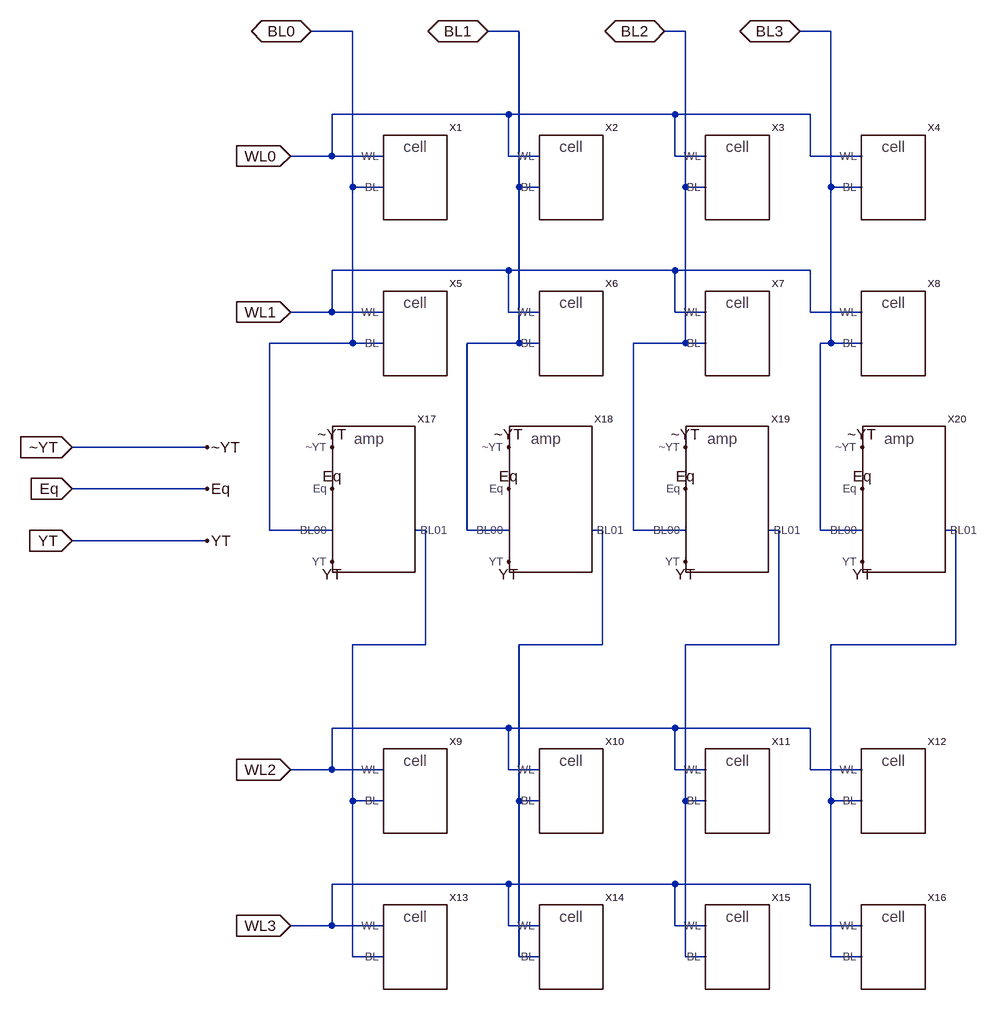
[diagram p0: schematic open_bitline_array.asc]
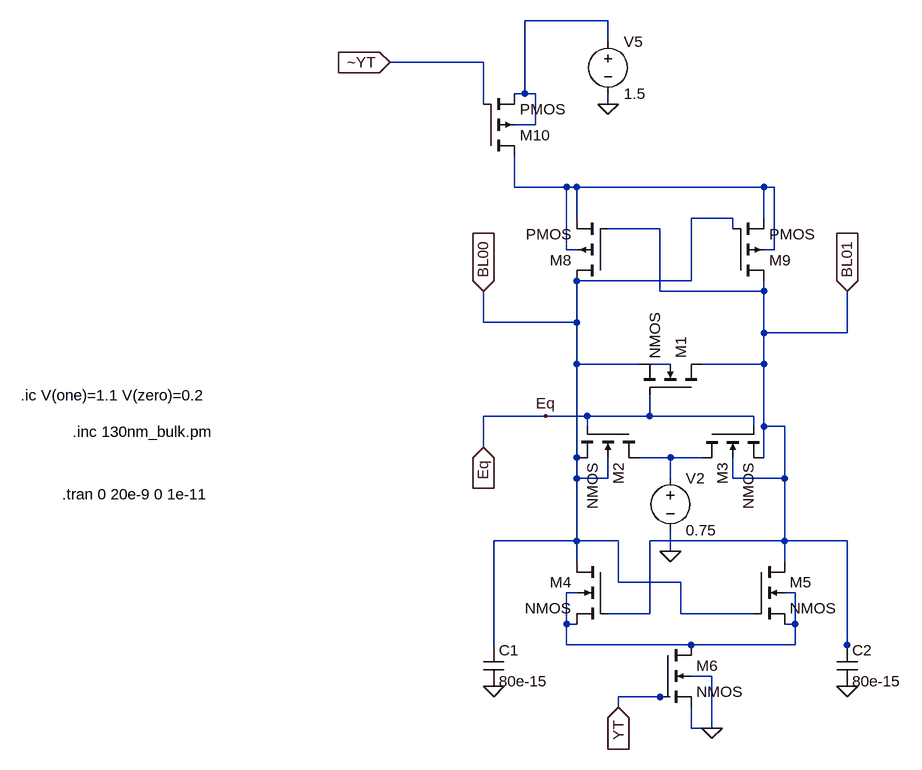
[diagram p1: sub-circuit amplifaer.asc]
open_bitline_array.asc, the LTspice schematic file:
Version 4
SHEET 1 984 1560
WIRE 0 -96 -64 -96
WIRE 256 -96 208 -96
WIRE 512 -96 480 -96
WIRE 736 -96 688 -96
WIRE 240 32 -32 32
WIRE 496 32 240 32
WIRE 704 32 496 32
WIRE -32 96 -32 32
WIRE -32 96 -96 96
WIRE 48 96 -32 96
WIRE 240 96 240 32
WIRE 288 96 240 96
WIRE 496 96 496 32
WIRE 544 96 496 96
WIRE 704 96 704 32
WIRE 784 96 704 96
WIRE 0 144 0 -96
WIRE 48 144 0 144
WIRE 256 144 256 -96
WIRE 288 144 256 144
WIRE 512 144 512 -96
WIRE 544 144 512 144
WIRE 736 144 736 -96
WIRE 784 144 736 144
WIRE 240 272 -32 272
WIRE 496 272 240 272
WIRE 704 272 496 272
WIRE -32 336 -32 272
WIRE -32 336 -96 336
WIRE 48 336 -32 336
WIRE 240 336 240 272
WIRE 288 336 240 336
WIRE 496 336 496 272
WIRE 544 336 496 336
WIRE 704 336 704 272
WIRE 784 336 704 336
WIRE 0 384 0 144
WIRE 0 384 -128 384
WIRE 48 384 0 384
WIRE 256 384 256 144
WIRE 256 384 176 384
WIRE 288 384 256 384
WIRE 512 384 512 144
WIRE 512 384 432 384
WIRE 544 384 512 384
WIRE 736 384 736 144
WIRE 736 384 720 384
WIRE 784 384 736 384
WIRE -224 544 -432 544
WIRE -224 608 -432 608
WIRE -128 672 -128 384
WIRE -32 672 -128 672
WIRE 112 672 96 672
WIRE 176 672 176 384
WIRE 240 672 176 672
WIRE 384 672 368 672
WIRE 432 672 432 384
WIRE 512 672 432 672
WIRE 656 672 640 672
WIRE 720 672 720 384
WIRE 784 672 720 672
WIRE 928 672 912 672
WIRE -224 688 -432 688
WIRE 112 848 112 672
WIRE 112 848 0 848
WIRE 384 848 384 672
WIRE 384 848 256 848
WIRE 656 848 656 672
WIRE 656 848 512 848
WIRE 928 848 928 672
WIRE 928 848 736 848
WIRE 240 976 -32 976
WIRE 496 976 240 976
WIRE 704 976 496 976
WIRE -32 1040 -32 976
WIRE -32 1040 -96 1040
WIRE 48 1040 -32 1040
WIRE 240 1040 240 976
WIRE 288 1040 240 1040
WIRE 496 1040 496 976
WIRE 544 1040 496 1040
WIRE 704 1040 704 976
WIRE 784 1040 704 1040
WIRE 0 1088 0 848
WIRE 48 1088 0 1088
WIRE 256 1088 256 848
WIRE 288 1088 256 1088
WIRE 512 1088 512 848
WIRE 544 1088 512 1088
WIRE 736 1088 736 848
WIRE 784 1088 736 1088
WIRE 240 1216 -32 1216
WIRE 496 1216 240 1216
WIRE 704 1216 496 1216
WIRE -32 1280 -32 1216
WIRE -32 1280 -96 1280
WIRE 48 1280 -32 1280
WIRE 240 1280 240 1216
WIRE 288 1280 240 1280
WIRE 496 1280 496 1216
WIRE 544 1280 496 1280
WIRE 704 1280 704 1216
WIRE 784 1280 704 1280
WIRE 0 1328 0 1088
WIRE 48 1328 0 1328
WIRE 256 1328 256 1088
WIRE 288 1328 256 1328
WIRE 512 1328 512 1088
WIRE 544 1328 512 1328
WIRE 736 1328 736 1088
WIRE 784 1328 736 1328
FLAG -32 544 ~YT
FLAG 240 544 ~YT
FLAG 784 544 ~YT
FLAG -32 608 Eq
FLAG 240 608 Eq
FLAG 784 608 Eq
FLAG -32 720 YT
FLAG 240 720 YT
FLAG 784 720 YT
FLAG -96 96 WL0
IOPIN -96 96 In
FLAG -96 336 WL1
IOPIN -96 336 In
FLAG -96 1040 WL2
IOPIN -96 1040 In
FLAG -96 1280 WL3
IOPIN -96 1280 In
FLAG -64 -96 BL0
IOPIN -64 -96 BiDir
FLAG 208 -96 BL1
IOPIN 208 -96 BiDir
FLAG 480 -96 BL2
IOPIN 480 -96 BiDir
FLAG 688 -96 BL3
IOPIN 688 -96 BiDir
FLAG -224 544 ~YT
FLAG -224 688 YT
FLAG -224 608 Eq
FLAG -432 544 ~YT
IOPIN -432 544 In
FLAG -432 608 Eq
IOPIN -432 608 In
FLAG -432 688 YT
IOPIN -432 688 In
FLAG 512 608 Eq
FLAG 512 544 ~YT
FLAG 512 720 YT
SYMBOL memory_cell 368 128 R0
SYMATTR InstName X2
SYMBOL memory_cell 624 128 R0
SYMATTR InstName X3
SYMBOL memory_cell 864 128 R0
SYMATTR InstName X4
SYMBOL memory_cell 128 368 R0
SYMATTR InstName X5
SYMBOL memory_cell 368 368 R0
SYMATTR InstName X6
SYMBOL memory_cell 624 368 R0
SYMATTR InstName X7
SYMBOL memory_cell 864 368 R0
SYMATTR InstName X8
SYMBOL memory_cell 128 1072 R0
SYMATTR InstName X9
SYMBOL memory_cell 368 1072 R0
SYMATTR InstName X10
SYMBOL memory_cell 624 1072 R0
SYMATTR InstName X11
SYMBOL memory_cell 864 1072 R0
SYMATTR InstName X12
SYMBOL memory_cell 128 1312 R0
SYMATTR InstName X13
SYMBOL memory_cell 368 1312 R0
SYMATTR InstName X14
SYMBOL memory_cell 624 1312 R0
SYMATTR InstName X15
SYMBOL memory_cell 864 1312 R0
SYMATTR InstName X16
SYMBOL amplifaer 80 576 R0
SYMATTR InstName X17
SYMBOL memory_cell 128 128 R0
SYMATTR InstName X1
SYMBOL amplifaer 352 576 R0
SYMATTR InstName X18
SYMBOL amplifaer 624 576 R0
SYMATTR InstName X19
SYMBOL amplifaer 896 576 R0
SYMATTR InstName X20

amplifaer.asc, the sub-circuit schematic file:
Version 4
SHEET 1 880 680
WIRE 208 -544 80 -544
WIRE 208 -512 208 -544
WIRE 16 -480 -128 -480
WIRE 80 -432 80 -544
WIRE 80 -432 64 -432
WIRE 96 -432 80 -432
WIRE 16 -416 16 -480
WIRE 208 -416 208 -432
WIRE 96 -384 96 -432
WIRE 96 -384 64 -384
WIRE 64 -288 64 -336
WIRE 144 -288 64 -288
WIRE 160 -288 144 -288
WIRE 448 -288 160 -288
WIRE 464 -288 448 -288
WIRE 160 -240 160 -288
WIRE 400 -240 336 -240
WIRE 448 -240 448 -288
WIRE 288 -224 208 -224
WIRE 400 -224 400 -240
WIRE 144 -192 144 -288
WIRE 160 -192 144 -192
WIRE 464 -192 464 -288
WIRE 464 -192 448 -192
WIRE 336 -144 336 -240
WIRE 336 -144 160 -144
WIRE 288 -128 288 -224
WIRE 448 -128 448 -144
WIRE 448 -128 288 -128
WIRE 16 -80 16 -128
WIRE 160 -80 160 -144
WIRE 160 -80 16 -80
WIRE 448 -64 448 -128
WIRE 576 -64 576 -128
WIRE 576 -64 448 -64
WIRE 160 -16 160 -80
WIRE 256 -16 160 -16
WIRE 304 -16 272 -16
WIRE 448 -16 448 -64
WIRE 448 -16 352 -16
WIRE 112 64 16 64
WIRE 176 64 112 64
WIRE 272 64 272 32
WIRE 272 64 176 64
WIRE 432 64 272 64
WIRE 176 80 176 64
WIRE 432 80 432 64
WIRE 448 80 448 -16
WIRE 480 80 448 80
WIRE 16 112 16 64
WIRE 160 128 160 -16
WIRE 304 128 256 128
WIRE 352 128 304 128
WIRE 448 128 448 80
WIRE 160 160 160 128
WIRE 208 160 208 128
WIRE 208 160 160 160
WIRE 304 160 304 128
WIRE 400 160 400 128
WIRE 480 160 480 80
WIRE 480 160 400 160
WIRE 160 256 160 160
WIRE 160 256 32 256
WIRE 224 256 160 256
WIRE 480 256 480 160
WIRE 480 256 272 256
WIRE 576 256 480 256
WIRE 304 272 304 240
WIRE 160 288 160 256
WIRE 480 288 480 256
WIRE 224 320 224 256
WIRE 320 320 224 320
WIRE 160 336 144 336
WIRE 496 336 480 336
WIRE 272 368 272 256
WIRE 272 368 208 368
WIRE 320 368 320 320
WIRE 432 368 320 368
WIRE 144 384 144 336
WIRE 160 384 144 384
WIRE 496 384 496 336
WIRE 496 384 480 384
WIRE 32 416 32 256
WIRE 144 416 144 384
WIRE 336 416 144 416
WIRE 496 416 496 384
WIRE 496 416 336 416
WIRE 576 416 576 256
WIRE 576 432 576 416
WIRE 368 464 336 464
WIRE 288 496 224 496
WIRE 304 496 288 496
WIRE 224 512 224 496
WIRE 336 544 336 512
WIRE 368 544 368 464
WIRE 368 544 336 544
FLAG 304 272 0
FLAG 576 480 0
FLAG 32 480 0
FLAG 368 544 0
FLAG 112 64 Eq
FLAG 208 -416 0
FLAG 16 112 Eq
IOPIN 16 112 In
FLAG -128 -480 ~YT
IOPIN -128 -480 In
FLAG 16 -128 BL00
IOPIN 16 -128 In
FLAG 224 512 YT
IOPIN 224 512 In
FLAG 576 -128 BL01
IOPIN 576 -128 In
SYMBOL nmos4 352 32 M270
SYMATTR InstName M1
SYMATTR Value2 l=130e-9 w=1300e-9 ad=676000e-18 as=676000e-18 pd=3640e-9 ps=3640e-9
SYMBOL nmos4 256 80 R90
SYMATTR InstName M2
SYMATTR Value2 l=130e-9 w=1300e-9 ad=676000e-18 as=676000e-18 pd=3640e-9 ps=3640e-9
SYMBOL nmos4 352 80 M90
SYMATTR InstName M3
SYMATTR Value2 l=130e-9 w=1300e-9 ad=676000e-18 as=676000e-18 pd=3640e-9 ps=3640e-9
SYMBOL voltage 304 144 R0
WINDOW 123 0 0 Left 0
WINDOW 39 0 0 Left 0
SYMATTR InstName V2
SYMATTR Value 0.75
SYMBOL cap 16 416 R0
SYMATTR InstName C1
SYMATTR Value 80e-15
SYMBOL cap 560 416 R0
SYMATTR InstName C2
SYMATTR Value 80e-15
SYMBOL nmos4 208 288 M0
SYMATTR InstName M4
SYMATTR Value2 l=130e-9 w=1300e-9 ad=676000e-18 as=676000e-18 pd=3640e-9 ps=3640e-9
SYMBOL nmos4 432 288 R0
SYMATTR InstName M5
SYMATTR Value2 l=130e-9 w=1300e-9 ad=676000e-18 as=676000e-18 pd=3640e-9 ps=3640e-9
SYMBOL nmos4 288 416 R0
SYMATTR InstName M6
SYMATTR Value2 l=130e-9 w=1300e-9 ad=676000e-18 as=676000e-18 pd=3640e-9 ps=3640e-9
SYMBOL pmos4 208 -144 R180
SYMATTR InstName M8
SYMATTR Value2 l=130e-9 w=2600e-9 ad=676000e-18 as=676000e-18 pd=3640e-9 ps=3640e-9
SYMBOL pmos4 400 -144 M180
SYMATTR InstName M9
SYMATTR Value2 l=130e-9 w=12600e-9 ad=676000e-18 as=676000e-18 pd=3640e-9 ps=3640e-9
SYMBOL pmos4 16 -336 M180
SYMATTR InstName M10
SYMATTR Value2 l=130e-9 w=2600e-9 ad=676000e-18 as=676000e-18 pd=3640e-9 ps=3640e-9
SYMBOL voltage 208 -528 R0
WINDOW 123 0 0 Left 0
WINDOW 39 0 0 Left 0
SYMATTR InstName V5
SYMATTR Value 1.5
TEXT -616 88 Left 2 !.inc 130nm_bulk.pm
TEXT -632 184 Left 2 !.tran 0 20e-9 0 1e-11
TEXT -696 32 Left 2 !.ic V(one)=1.1 V(zero)=0.2

The netlist it stands for:
* open_bitline_array.asc
XX2 WL0 BL1 memory_cell  ; pins WL BL
XX3 WL0 BL2 memory_cell  ; pins WL BL
XX4 WL0 BL3 memory_cell  ; pins WL BL
XX5 WL1 BL0 memory_cell  ; pins WL BL
XX6 WL1 BL1 memory_cell  ; pins WL BL
XX7 WL1 BL2 memory_cell  ; pins WL BL
XX8 WL1 BL3 memory_cell  ; pins WL BL
XX9 WL2 N001 memory_cell  ; pins WL BL
XX10 WL2 N002 memory_cell  ; pins WL BL
XX11 WL2 N003 memory_cell  ; pins WL BL
XX12 WL2 N004 memory_cell  ; pins WL BL
XX13 WL3 N001 memory_cell  ; pins WL BL
XX14 WL3 N002 memory_cell  ; pins WL BL
XX15 WL3 N003 memory_cell  ; pins WL BL
XX16 WL3 N004 memory_cell  ; pins WL BL
XX17 Eq YT ~YT BL0 N001 amplifaer
XX1 WL0 BL0 memory_cell  ; pins WL BL
XX18 Eq YT ~YT BL1 N002 amplifaer
XX19 Eq YT ~YT BL2 N003 amplifaer
XX20 Eq YT ~YT BL3 N004 amplifaer

* block symbol definitions
.subckt amplifaer Eq YT ~YT BL00 BL01
M1 BL01 Eq BL00 N003 NMOS l=130e-9 w=1300e-9 ad=676000e-18 as=676000e-18 pd=3640e-9 ps=3640e-9
M2 N004 Eq BL00 BL00 NMOS l=130e-9 w=1300e-9 ad=676000e-18 as=676000e-18 pd=3640e-9 ps=3640e-9
M3 N004 Eq BL01 BL01 NMOS l=130e-9 w=1300e-9 ad=676000e-18 as=676000e-18 pd=3640e-9 ps=3640e-9
V2 N004 0 0.75
C1 BL00 0 80e-15
C2 BL01 0 80e-15
M4 BL00 BL01 N005 N005 NMOS l=130e-9 w=1300e-9 ad=676000e-18 as=676000e-18 pd=3640e-9 ps=3640e-9
M5 BL01 BL00 N005 N005 NMOS l=130e-9 w=1300e-9 ad=676000e-18 as=676000e-18 pd=3640e-9 ps=3640e-9
M6 N005 YT 0 0 NMOS l=130e-9 w=1300e-9 ad=676000e-18 as=676000e-18 pd=3640e-9 ps=3640e-9
M8 BL00 BL01 N002 N002 PMOS l=130e-9 w=2600e-9 ad=676000e-18 as=676000e-18 pd=3640e-9 ps=3640e-9
M9 BL01 BL00 N002 N002 PMOS l=130e-9 w=12600e-9 ad=676000e-18 as=676000e-18 pd=3640e-9 ps=3640e-9
M10 N002 ~YT N001 N001 PMOS l=130e-9 w=2600e-9 ad=676000e-18 as=676000e-18 pd=3640e-9 ps=3640e-9
V5 N001 0 1.5
.inc 130nm_bulk.pm
.tran 0 20e-9 0 1e-11
.ic V(one)=1.1 V(zero)=0.2
.ends amplifaer

.model NMOS NMOS
.model PMOS PMOS
.lib standard.mos
.backanno
.end